# Altium schematic sheet supply.SchDoc: Jetson Xavier NX Board
size A3; PageSetup: Record=PageOptions|CenterHorizontal=True|CenterVertical=True|PrintScale=0.97|XCorrection=1.00|YCorrection=1.00|PrintKind=1|BorderSize=5000000|LeftOffset=0|BottomOffset=0|Orientation=2|PaperLength=2970|PaperWidth=2100|Scale=100|PaperSource=7|PrintQuality=600|MediaType=1|DitherType=10|PaperKind=A4|PrintScaleMode=1; Organization: Altium Limited; Address1: 3 Minna Close; Address2: Belrose; Address3: NSW 2085; Address4: Australia; Revision: Rev01
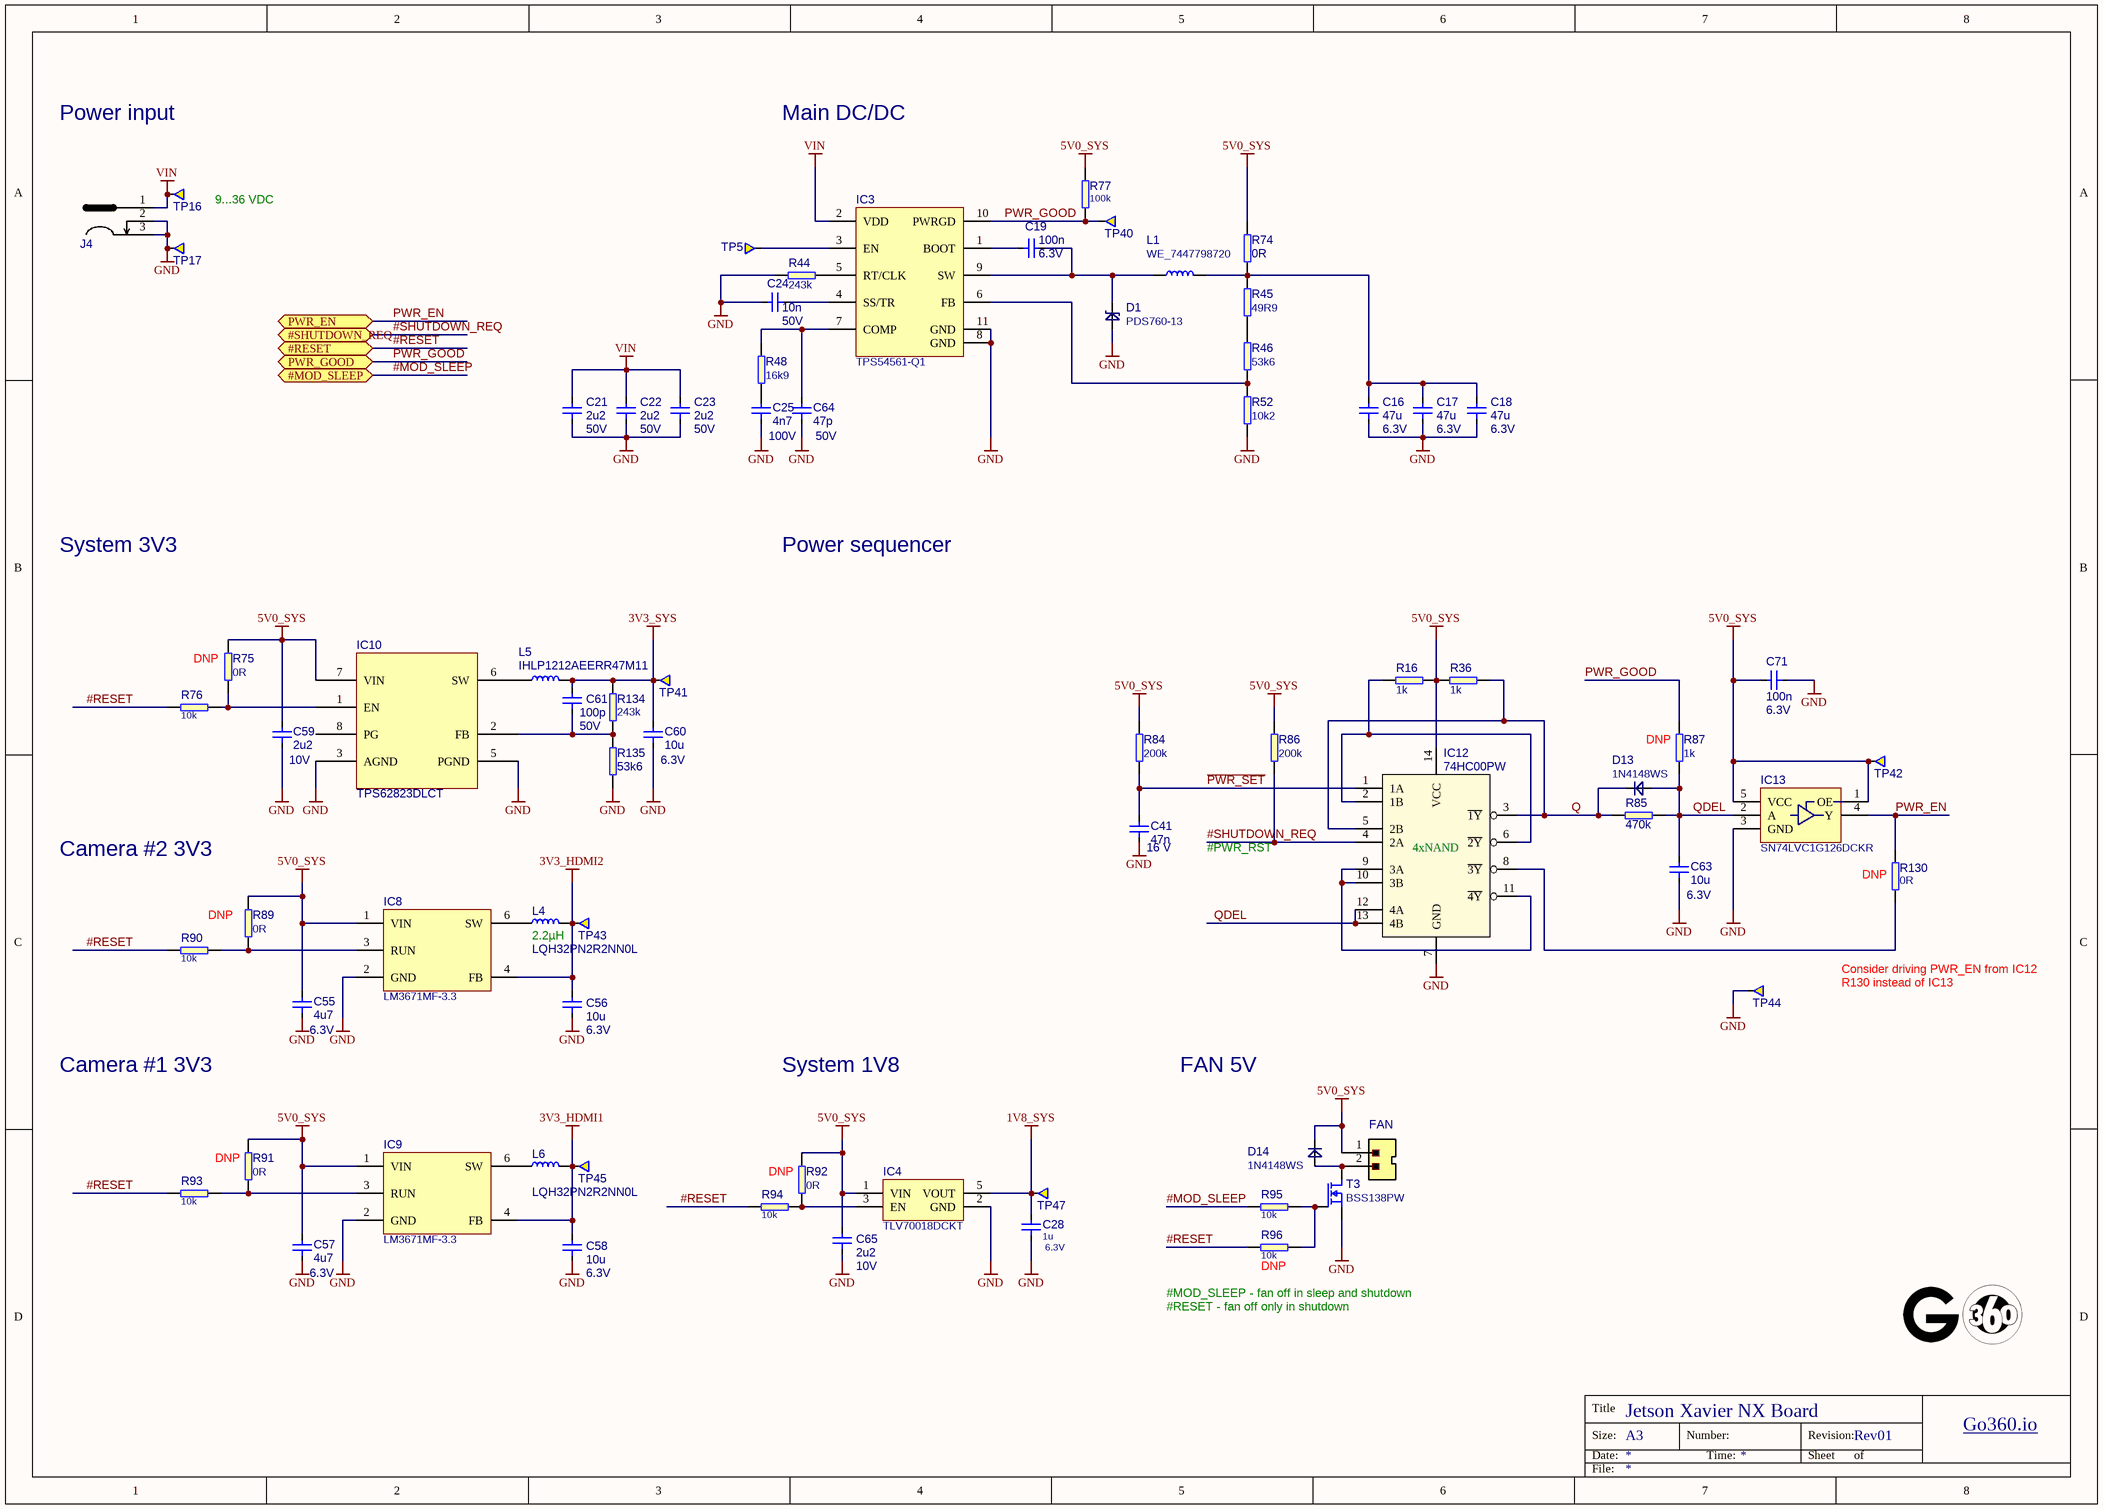
[diagram p0: supply.SchDoc]

## Parts
C16  Voltage: 6.3V  [0805]  (hidden comment: 47u)
C17  Voltage: 6.3V  [0805]  (hidden comment: 47u)
C18  Voltage: 6.3V  [0805]  (hidden comment: 47u)
C19  Voltage: 6.3V  [0402]  (hidden comment: 100n)
C21  Voltage: 50V  [1206]  (hidden comment: 2u2)
C22  Voltage: 50V  [1206]  (hidden comment: 2u2)
C23  Voltage: 50V  [1206]  (hidden comment: 2u2)
C24  Voltage: 50V  [0402]  (hidden comment: 10n)
C25  Voltage: 100V  [0402]  (hidden comment: 4n7)
C28  Voltage: 6.3V  [0402]  (hidden comment: 1u)
C41  Voltage: 16 V  [0402]  (hidden comment: 47n)
C55  Voltage: 6.3V  [0402]  (hidden comment: 4u7)
C56  Voltage: 6.3V  [0603]  (hidden comment: 10u)
C57  Voltage: 6.3V  [0402]  (hidden comment: 4u7)
C58  Voltage: 6.3V  [0603]  (hidden comment: 10u)
C59  Voltage: 10V  [0402]  (hidden comment: 2u2)
C60  Voltage: 6.3V  [0603]  (hidden comment: 10u)
C61  Voltage: 50V  [0402]  (hidden comment: 100p)
C63  Voltage: 6.3V  [0603]  (hidden comment: 10u)
C64  Voltage: 50V  [0402]  (hidden comment: 47p)
C65  Voltage: 10V  [0402]  (hidden comment: 2u2)
C71  Voltage: 6.3V  [0402]  (hidden comment: 100n)
D1  PDS760-13  [PowerDI]
D13  1N4148WS  [SOD-323]
D14  1N4148WS  [SOD-323]
FAN  MX-22-23-2021  [molex_2223-2021]  (value not drawn)
IC3  TPS54561-Q1  [WSON-10_4x4]
IC4  TLV70018DCKT  [SC70-5]
IC8  LM3671MF-3.3  [SOT23-5N]
IC9  LM3671MF-3.3  [SOT23-5N]
IC10  TPS62823DLCT  [TPS62823]
IC12  74HC00PW  [TSSOP-14]
IC13  SN74LVC1G126DCKR  [R-PDSO-G5]
J4  MJ-179PH  [DC_SOCKET]  (value not drawn)
L1  WE_7447798720  [WE_7447798720]
L4  LQH32PN2R2NN0L  [LQH32PN2R2NN0L]
L5  IHLP1212AEERR47M11  [IHLP-1212AE]
L6  LQH32PN2R2NN0L  [LQH32PN2R2NN0L]
R16  1k  [0402]
R36  1k  [0402]
R44  243k  [0402]
R45  49R9  [0402]
R46  53k6  [0402]
R48  16k9  [0402]
R52  10k2  [0402]
R74  0R  [0805]
R75  0R  [0402]
R76  10k  [0402]
R77  100k  [0402]
R84  200k  [0402]
R85  470k  [0402]
R86  200k  [0402]
R87  1k  [0402]
R89  0R  [0402]
R90  10k  [0402]
R91  0R  [0402]
R92  0R  [0402]
R93  10k  [0402]
R94  10k  [0402]
R95  10k  [0402]
R96  10k  [0402]
R130  0R  [0402]
R134  243k  [0402]
R135  53k6  [0402]
T3  BSS138PW  [SC70-3]
TP5  Testpad  [TP-R-1.5]  (value not drawn)  (no BOM)
TP16  Testpad  [TP-R-1.5]  (value not drawn)  (no BOM)
TP17  Testpad  [TP-R-1.5]  (value not drawn)  (no BOM)
TP40  Testpad  [TP-R-1.5]  (value not drawn)  (no BOM)
TP41  Testpad  [TP-R-1.5]  (value not drawn)  (no BOM)
TP42  Testpad  [TP-R-1.5]  (value not drawn)  (no BOM)
TP43  Testpad  [TP-R-1.5]  (value not drawn)  (no BOM)
TP44  Testpad  [TP-R-1.5]  (value not drawn)  (no BOM)
TP45  Testpad  [TP-R-1.5]  (value not drawn)  (no BOM)
TP47  Testpad  [TP-R-1.5]  (value not drawn)  (no BOM)

## Ports
#MOD_SLEEP, #RESET, #SHUTDOWN_REQ, PWR_EN, PWR_GOOD

## Nets
1V8_SYS: C28.2 IC4.5(VOUT) TP47.1
3V3_HDMI1: C58.2 IC9.4(FB) L6.2 TP45.1
3V3_HDMI2: C56.2 IC8.4(FB) L4.2 TP43.1
3V3_SYS: C60.2 C61.2 L5.2 R134.1 TP41.1
5V0_SYS: C55.2 C57.2 C59.2 C65.2 C71.2 D14.C FAN.1 IC4.1(VIN) IC8.1(VIN) IC9.1(VIN) IC10.7(VIN) IC12.14(VCC) IC13.1(OE) IC13.5(VCC) R16.1 R36.2 R74.2 R75.2 R77.2 R84.2 R86.2 R89.2 R91.2 R92.1 TP42.1
GND: C16.1 C17.1 C18.1 C21.1 C22.1 C23.1 C24.2 C25.1 C28.1 C41.1 C55.1 C56.1 C57.1 C58.1 C59.1 C60.1 C63.1 C64.1 C65.1 C71.1 D1.A IC3.8(GND) IC3.11(GND) IC4.2(GND) IC8.2(GND) IC9.2(GND) IC10.3(AGND) IC10.5(PGND) IC12.7(GND) IC13.3(GND) J4.2 J4.3 R44.2 R52.1 R135.1 T3.2(S) TP17.1 TP44.1
VIN: C21.2 C22.2 C23.2 IC3.2(VDD) J4.1 TP16.1
#MOD_SLEEP: R95.2 ; port #MOD_SLEEP
#RESET: R76.2 R90.2 R93.2 R94.2 R96.2 ; port #RESET
#SHUTDOWN_REQ: IC12.4(2A) R86.1 ; port #SHUTDOWN_REQ
~{PWR_SET}: C41.2 IC12.1(1A) R84.1
PWR_EN: IC13.4(Y) R130.1 ; port PWR_EN
PWR_GOOD: IC3.10(PWRGD) R77.1 R87.1 TP40.1 ; port PWR_GOOD
Q: D13.C IC12.3(~{1Y}) IC12.5(2B) R36.1 R85.1
QDEL: C63.2 D13.A IC12.12(4A) IC12.13(4B) IC13.2(A) R85.2 R87.2
NetC16_2: C16.2 C17.2 C18.2 L1.2 R45.2 R74.1
NetC19_1: C19.1 IC3.1(BOOT)
NetC19_2: C19.2 D1.C IC3.9(SW) L1.1
NetC24_1: C24.1 IC3.4(SS/TR)
NetC25_2: C25.2 R48.1
NetC61_1: C61.1 IC10.2(FB) R134.2 R135.2
NetC64_2: C64.2 IC3.7(COMP) R48.2
NetD14_A: D14.A FAN.2 T3.3(D)
NetIC3_3: IC3.3(EN) TP5.1
NetIC3_5: IC3.5(RT/CLK) R44.1
NetIC3_6: IC3.6(FB) R46.1 R52.2
NetIC4_3: IC4.3(EN) R92.2 R94.1
NetIC8_3: IC8.3(RUN) R89.1 R90.1
NetIC8_6: IC8.6(SW) L4.1
NetIC9_3: IC9.3(RUN) R91.1 R93.1
NetIC9_6: IC9.6(SW) L6.1
NetIC10_1: IC10.1(EN) R75.1 R76.1
NetIC10_6: IC10.6(SW) L5.1
NetIC12_2: IC12.2(1B) IC12.6(~{2Y}) R16.2
NetIC12_8: IC12.8(~{3Y}) R130.2
NetIC12_9: IC12.9(3A) IC12.10(3B) IC12.11(~{4Y})
NetR45_1: R45.1 R46.2
NetR95_1: R95.1 R96.1 T3.1(G)

Not connected (* = marked no-connect by the designer): IC10 8(PG)

## Notes on the sheet
- Power input
- Main DC/DC
- 9...36 VDC
- System 3V3
- Power sequencer
- (near R75) DNP
- (near R87) DNP
- Camera #2 3V3
- #PWR_RST
- DNP
- (near R130) DNP
- (near L4) 2.2µH
- R130 instead of IC13
- Consider driving PWR_EN from IC12
- Camera #1 3V3
- System 1V8
- FAN 5V
- (near R91) DNP
- (near R96) #MOD_SLEEP - fan off in sleep and shutdown
- #RESET - fan off only in shutdown
- (near R96) DNP
- Title
- Size:
- Date:
- A3
- Number:
- Time:
- Revision:
- Sheet
- of
- Go360.io
- File:
- (in symbol 74HC00PW) 4xNAND

## Library data of the parts
C16-C18 = C_47u_0805: MLCC SMT Capacitor 47uF 0805; Manufacturer: KEMET; PartSymbol: C0805C476M9PACTU; PartNumber: C_47u_0805; Value: 47u
C19 C71 = C_100n_0402: MLCC SMT Capacitor 100n 0402; Manufacturer: TDK; PartSymbol: C1005X5R0J104K050BA; Value: 100n; PartNumber: C_100n_0402
C21-C23 = C_2u2_1206: MLCC SMT Capacitor 2.2uF 1206; Manufacturer: KEMET; PartSymbol: C1206C225J5RACTU; PartNumber: C_2u2_1206; Value: 2u2
C24 = C_10n_0402: MLCC SMT Capacitor 10 nF 0402; Manufacturer: AVX; PartSymbol: 04025G103ZAT2A; PartNumber: C_10n_0402; Value: 10n
C25 = C_4n7_0402: MLCC SMT Capacitor 4.7 nF 0402; Manufacturer: TDK; PartSymbol: CGA2B3X7S2A472K050BB; PartNumber: C_4n7_0402; Value: 4n7
C28 = C_1u_0402: MLCC SMT Capacitor 1uF 0402; Manufacturer: MULTICOMP; PartSymbol: MC0402F105Z6R3CT; PartNumber: C_1u_0402; Value: 1u
C41 = C_47n_0402: MLCC SMT Capacitor 47nF 0402; Manufacturer: MULTICOMP; PartSymbol: MC0402X473K160CT; PartNumber: C_47n_0402; Value: 47n
C55 C57 = C_4u7_0402: MLCC SMT Capacitor 4.7uF 0402; Manufacturer: MURATA; PartSymbol: GRM155R60J475ME87D; PartNumber: C_4u7_0402; Value: 4u7
C56 C58 C60 C63 = C_10u_0603: MLCC SMT Capacitor 10uF 0603; Manufacturer: Walsin; PartSymbol: 0603X106M6R3CT; Value: 10u; PartNumber: C_10u_0603
C59 C65 = C_2u2_0402: MLCC SMT Capacitor 2.2uF 0402; Manufacturer: TDK; PartSymbol: C1005X5R1A225K050BC; Value: 2u2; PartNumber: C_2u2_0402
C61 = C_100p_0402: MLCC SMT Capacitor 100pF 0402; Manufacturer: WALSIN; PartSymbol: 0402N101J500CT; PartNumber: C_100p_0402; Value: 100p
C64 = C_47p_0402: MLCC SMT Capacitor 47pF 0402; Manufacturer: KEMET; PartSymbol: C0402C470J5GACTU; PartNumber: C_47p_0402; Value: 47p
D1 = Diode Schottky: DIODE SCHOTTKY 60V 7A POWERDI5; Manufacturer: DIODES INC.; PartNumber: PDS760-13; Value: PDS760-13; PartSymbol: PDS760-13
D13 D14 = diode: Diode small signal; Manufacturer: ON SEMICONDUCTOR; PartNumber: 1N4148WS; Value: 1N4148WS; PartSymbol: 1N4148WS
FAN = molex_2223-2021: Pinhead connector with key; Manufacturer: Molex; PartSymbol: 022232021 A-6373-02A222; Value: MX-22-23-2021; PartNumber: molex_2223-2021
IC3 = TPS54561: IC REG BCK SPLIT RAIL ADJ 10WSON; Manufacturer: TEXAS INSTRUMENTS; PartNumber: TPS54561-Q1; Value: TPS54561-Q1; PartSymbol: TPS54561-Q1
IC4 = TLV700: Voltage Regulator, 2V to 5.5V, 175mV Dropout, 1.8Vout, 200mAout; Manufacturer: TEXAS INSTRUMENTS; Value: TLV70018DCKT; PartNumber: TLV70018DCKT; PartSymbol: TLV70018DCKT
IC8 IC9 = LM3671: DC/DC Buck Converter; Manufacturer: TEXAS INSTRUMENTS; PartSymbol: LM3671MF-3.3/NOPB; Value: LM3671MF-3.3; PartNumber: LM3671MF-3.3
IC10 = TPS62823: IC REG BUCK ADJ 1A 8VSON-HR; Manufacturer: TEXAS INSTRUMENTS; PartNumber: TPS62823; Value: TPS62823DLCT; PartSymbol: TPS62823DLCT; Class: IC
IC12 = 74HC00PW: 2 NAND Gate, 4 channel; Manufacturer: NEXPERIA; PartNumber: 74HC00PW; Value: 74HC00PW; PartSymbol: 74HC00PW
IC13 = SN74LVC1G126: Buffer, tri-state; Manufacturer: Texas Instruments; PartNumber: SN74LVC1G126DCKR; Value: SN74LVC1G126DCKR; PartSymbol: SN74LVC1G126DCKR
J4 = DC_SOCKET: DC Power Connector, Jack, 4 A, 1.95 mm, PCB Mount, Through Hole; Manufacturer: MULTICOMP; PartNumber: DC_SOCKET; PartSymbol: MJ-179PH; Value: MJ-179PH
L1 = WE_7447798720: Fixed Inductors WE-PDF 1064 7.2uH 7.9A 12.8mOhm; Manufacturer: WURTH ELEKTRONIK; PartNumber: WE_7447798720; Value: WE_7447798720; PartSymbol: 7447798720; Inductance: 7.2uH; RatedCurrent: 7.9A
L4 L6 = LQH32PN2R2NN0L: INDUCTOR, 2.2 ?H, ? 30%, 1212, 90 MHz, 0.073 ohm; Manufacturer: MURATA; Inductance: 2.2uH; PartNumber: LQH32PN2R2NN0L; Value: LQH32PN2R2NN0L; PartSymbol: LQH32PN2R2NN0L
L5 = IHLP1212AEERR47M11: FIXED IND 470NH 6.7A 15 MOHM SMD; Manufacturer: VISHAY; Class: Inductance; PartNumber: IHLP1212AEERR47M11; Value: IHLP1212AEERR47M11; PartSymbol: IHLP1212AEERR47M11; Inductance: 470nH; RatedCurrent: 6.7A
R16 R36 R87 = R_1k_0402: RES, 1k, 0402; Manufacturer: BOURNS; PartSymbol: CR0402-FX-1001GLF; PartNumber: R_1k_0402; Value: 1k
R44 R134 = R_243k_0402: RES, 243k, 0402; Manufacturer: MULTICOMP; PartSymbol: MCMR04X2433FTL; PartNumber: R_243k_0402; Value: 243k
R45 = R_49R9_0402: RES, 49R9, 0402; Manufacturer: VISHAY; PartSymbol: CRCW040249R9FKED; PartNumber: R_49R9_0402; Value: 49R9
R46 R135 = R_53k6_0402: RES, 53k6, 0402; Manufacturer: TE CONECTIVITY; PartSymbol: CPF0402B53K6E1; PartNumber: R_53k6_0402; Value: 53k6
R48 = R_16k9_0402: RES, 16k9, 0402; Manufacturer: Panasonic; PartSymbol: ERA2AEB1692X; PartNumber: R_16k9_0402; Value: 16k9
R52 = R_10k2_0402: RES, 10k2, 0402, 0.1%; PartNumber: R_10k2_0402_0.1%; Manufacturer: TE CONECTIVITY; PartSymbol: CPF0402B10K2E1; Value: 10k2; Tolerance: 0.1%
R74 = R_0R_0805: RES, 0R, 0805; Manufacturer: BOURNS; PartSymbol: CR0805-J/-000ELF; PartNumber: R_0R_0805; Value: 0R
R75 R89 R91 R92 R130 = R_0R_0402: RES, 0R, 0402; Manufacturer: Panasonic; PartSymbol: ERJ2GE0R00X; PartNumber: R_0R_0402; Value: 0R
R76 R90 R93-R96 = R_10k_0402: RES, 10k, 0402; Manufacturer: MULTICOMP; PartSymbol: MCMR04X1002FTL; Tolerance: 1%; PartNumber: R_10k_0402; Value: 10k
R77 = R_100k_0402: SMT Resistor 100k 0402; Manufacturer: VISHAY; PartSymbol: CRCW0402100KFKEDHP; Tolerance: 1%; PartNumber: R_100k_0402; Value: 100k
R84 R86 = R_200k_0402: RES, 200k, 0402; Manufacturer: YAGEO; PartSymbol: RC0402FR-07200KL; PartNumber: R_200k_0402; Value: 200k
R85 = R_470k_0402: SMT Resistor 470k 0402; Manufacturer: VISHAY; PartSymbol: CRCW0402470KFKED; PartNumber: R_470k_0402; Value: 470k
T3 = NMOS: MOSFET, N CH, 60V, 0.2A; Manufacturer: NXP; Value: BSS138PW; PartNumber: BSS138PW; PartSymbol: BSS138PW
TP5 TP16 TP17 TP40-TP45 TP47 = Testpad: Testpad, round, 1.5mm; PartNumber: TP-R-1.5